# EAGLE design 5VAC-DCReg (EAGLE 9.6.2)
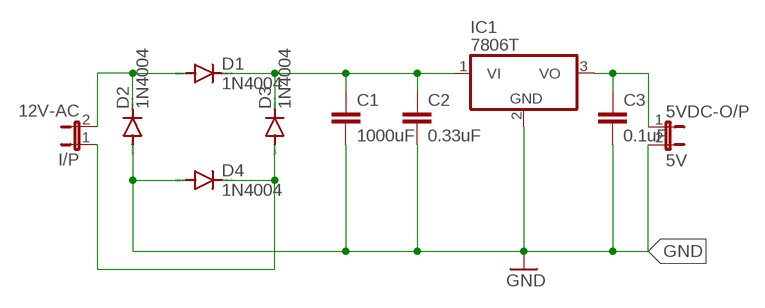
[diagram p0: schematic, sheet 1]

## Parts
5VDC-O/P  5V  JP1E  [JP1]
C1  1000uF  C2,5-3  [C2.5-3]
C2  0.33uF  C2,5-3  [C2.5-3]
C3  0.1uF  C2,5-3  [C2.5-3]
D1  1N4004  [DO41-10]
D2  1N4004  [DO41-10]
D3  1N4004  [DO41-10]
D4  1N4004  [DO41-10]
I/P  12V-AC  JP1E  [JP1]
IC1  7806T  [TO220H]

## Nets
GND: 5VDC-O/P.2 C1.2 C2.2 C3.2 D2.A D4.A IC1.2(GND)
N$1: D1.A D2.C I/P.2
N$2: C1.1 C2.1 D1.C D3.C IC1.1(VI)
N$4: D3.A D4.C I/P.1
N$5: 5VDC-O/P.1 C3.1 IC1.3(VO)

## Library data of the parts
5VDC-O/P I/P = jumper:JP1E: JUMPER
C1-C3 = capacitor-wima:C: CAPACITOR naming: grid - package width
D1-D4 = diode:1N4004: DIODE general purpose rectifier, 1 A
IC1 = linear:78*: Positive VOLTAGE REGULATOR Source: http://cache.national.com/ds/LM/LM78L05.pdf http://www.fairchildsemi.com/ds/LM/LM7805.pdf

## Board
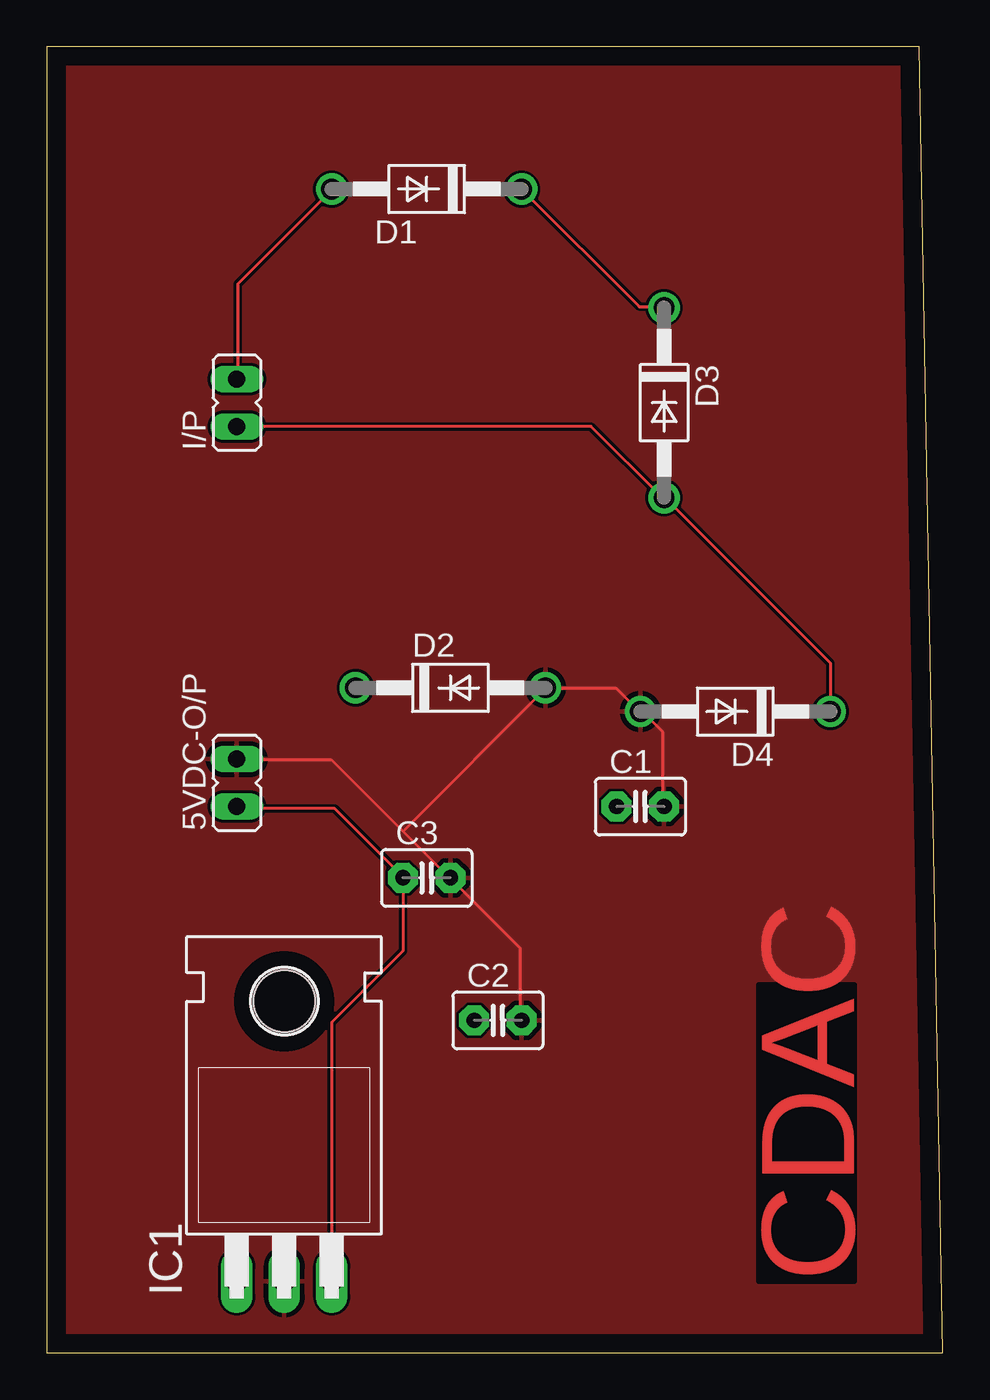
[diagram p1: board, top side]
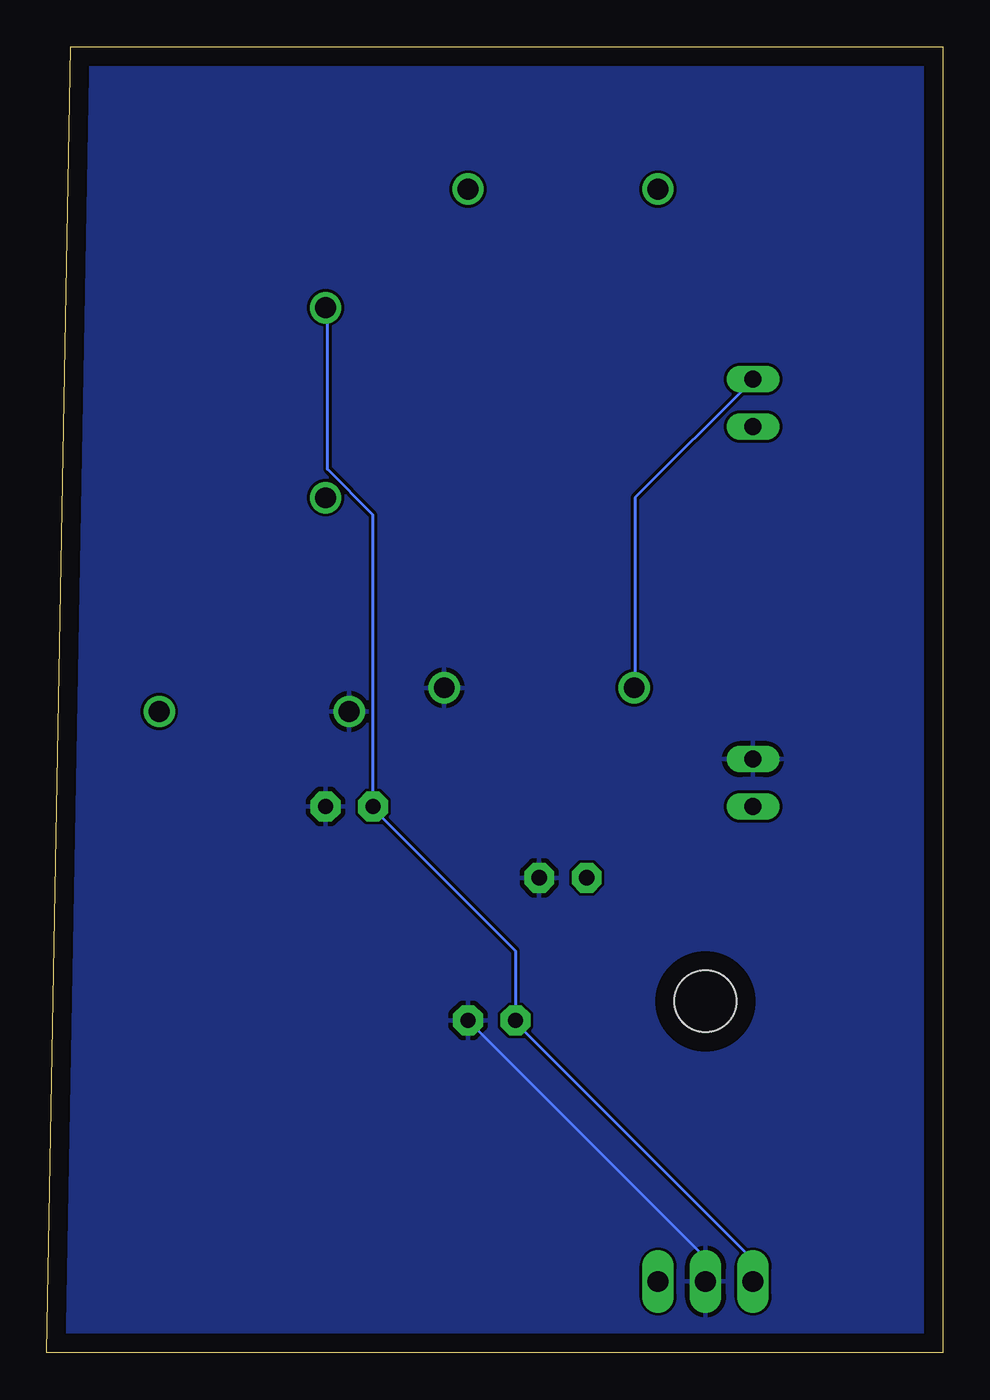
[diagram p2: board, bottom side, seen from below]

Size 47.93 x 69.84 mm. Coordinates in mm from the lower left corner, seen from the top.
Outline: 0,0 47.93,0 46.66,69.84 0,69.84 0,0
Copper layers (1*16): Top 0.035mm / dielectric 1.5mm / Bottom 0.035mm
Design rules "default": minimum track width 6mil, minimum drill 0.35mm, track to track 6mil, track to pad 6mil, pad to pad 6mil, via to via 6mil, smd to smd 6mil, copper to edge 40mil, drill to drill 6mil, minimum pad ring 10mil, minimum via ring 8mil, stop-mask expansion 4mil, vias tented up to drill 0mil, thermal gap 10mil

### Footprints (pad centres in the part's own frame; a part is rotated, then mirrored left to right if it is on the bottom)
JP1 = drill 0.914 long: 1 0,-1.27; 2 0,1.27
C2.5-3 = drill 0.813 pad 1.6 octagon: 1 -1.27,0; 2 1.27,0
DO41-10 = drill 1.118: A 5.08,0; C -5.08,0
TO220H = drill 1.118 long: 1 -2.54,-10.16; 2 0,-10.16; 3 2.54,-10.16 | hole 3.302: 0,4.826

### Placement (x,y rotation side)
5VDC-O/P  10.16,30.48 0 top
C1  31.75,29.21 0 top
C2  24.13,17.78 0 top
C3  20.32,25.4 0 top
D1  20.32,62.23 180 top
D2  21.59,35.56 0 top
D3  33.02,50.8 270 top
D4  36.83,34.29 180 top
I/P  10.16,50.8 0 top
IC1  12.7,13.97 0 top

### Tracks (layer width: path | path; a pad name or v marks a point on that pad's centre or on a via)
GND
  Top 0.152: C1.2 32.92,29.26 32.92,33.22 31.85,34.29 D4.A 31.7,34.29 30.48,35.51 26.67,35.51 | 19.05,27.89 21.49,25.45 C3.2 21.64,25.3 25.3,21.64 25.3,17.83 C2.2 | 19.05,27.89 15.24,31.7 10.21,31.7 5VDC-O/P.2 | 19.05,27.89 26.67,35.51 | 26.67,35.51 D2.A
  Bottom 0.152: C2.2 12.8,5.18 12.8,3.81 IC1.2
  pour Top: -15.24,77.47 58.42,77.47 80.01,55.88 80.01,22.86 46.99,-10.16 -15.24,-10.16 -17.78,-7.62 -17.78,74.93
  pour Bottom: -20.32,81.28 62.23,81.28 85.09,58.42 86.36,57.15 86.36,21.59 52.07,-12.7 -16.51,-12.7 -19.05,-10.16 -22.86,-6.35 -22.86,77.47 -22.86,78.74
N$1
  Top 0.152: I/P.2 10.21,52.12 10.21,57.15 15.24,62.18 D1.A
  Bottom 0.152: D2.C 16.46,35.66 16.46,45.72 10.21,51.97 I/P.2
N$2
  Top 0.152: D1.C 31.7,55.93 32.92,55.93 D3.C
  Bottom 0.152: IC1.1 10.21,3.81 10.21,5.03 22.86,17.68 C2.1 22.86,21.49 30.48,29.11 C1.1 30.48,44.81 32.92,47.24 32.92,55.78 D3.C
N$4
  Top 0.152: I/P.1 29.11,49.53 32.92,45.72 D3.A 33.07,45.72 41.91,36.88 D4.C
N$5
  Top 0.152: 5VDC-O/P.1 10.21,29.11 15.39,29.11 19.05,25.45 C3.1 19.05,21.49 15.24,17.68 IC1.3

### Text on the board
Top: CDAC